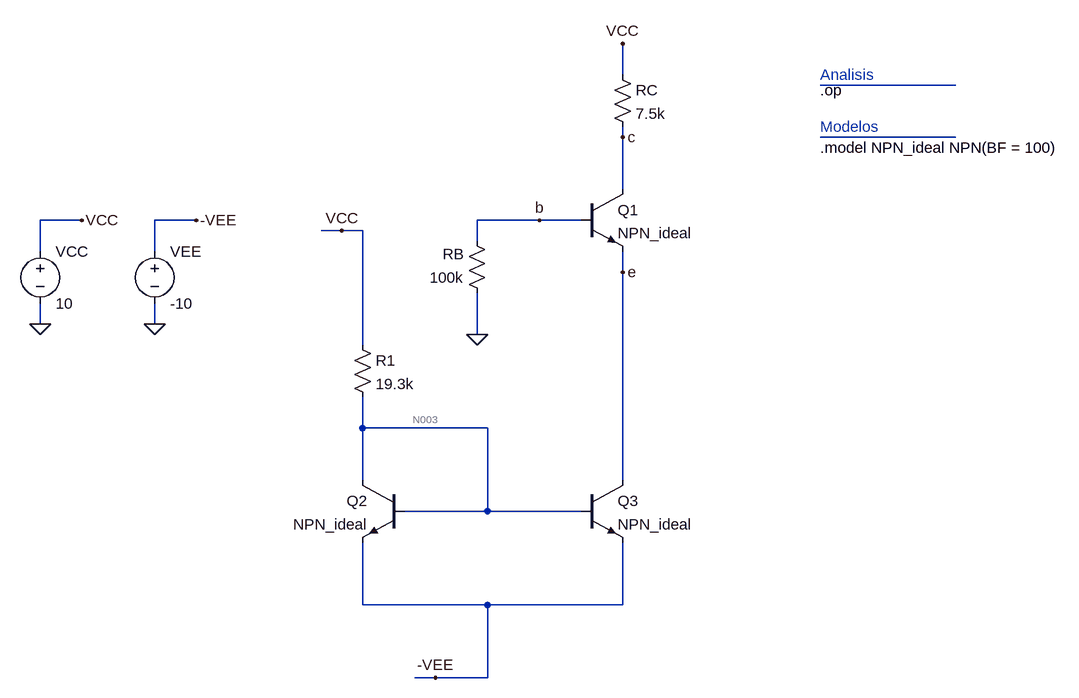
[diagram p0: schematic example4.asc]
example4.asc, the LTspice schematic file:
Version 4
SHEET 1 916 680
WIRE -368 -848 -368 -896
WIRE 144 -832 -64 -832
WIRE -368 -752 -368 -768
WIRE 144 -752 -64 -752
WIRE -368 -672 -368 -752
WIRE -1200 -624 -1264 -624
WIRE -1024 -624 -1088 -624
WIRE -496 -624 -592 -624
WIRE -432 -624 -496 -624
WIRE -800 -608 -832 -608
WIRE -768 -608 -800 -608
WIRE -592 -592 -592 -624
WIRE -1264 -576 -1264 -624
WIRE -1088 -576 -1088 -624
WIRE -368 -544 -368 -576
WIRE -1264 -464 -1264 -496
WIRE -1088 -464 -1088 -496
WIRE -592 -448 -592 -512
WIRE -768 -432 -768 -608
WIRE -768 -304 -768 -352
WIRE -576 -304 -768 -304
WIRE -768 -224 -768 -304
WIRE -368 -224 -368 -544
WIRE -576 -176 -576 -304
WIRE -576 -176 -704 -176
WIRE -432 -176 -576 -176
WIRE -768 -32 -768 -128
WIRE -576 -32 -768 -32
WIRE -368 -32 -368 -128
WIRE -368 -32 -576 -32
WIRE -656 80 -688 80
WIRE -576 80 -576 -32
WIRE -576 80 -656 80
FLAG -1264 -464 0
FLAG -496 -624 b
FLAG -368 -752 c
FLAG -368 -544 e
FLAG -1200 -624 VCC
FLAG -800 -608 VCC
FLAG -1088 -464 0
FLAG -1024 -624 -VEE
FLAG -656 80 -VEE
FLAG -368 -896 VCC
FLAG -592 -448 0
SYMBOL npn -432 -672 R0
SYMATTR InstName Q1
SYMATTR Value NPN_ideal
SYMBOL res -576 -496 R180
WINDOW 0 36 76 Left 2
WINDOW 3 36 40 Left 2
SYMATTR InstName RB
SYMATTR Value 100k
SYMBOL res -384 -864 R0
SYMATTR InstName RC
SYMATTR Value 7.5k
SYMBOL voltage -1264 -592 R0
WINDOW 123 0 0 Left 0
WINDOW 39 0 0 Left 0
SYMATTR InstName VCC
SYMATTR Value 10
SYMBOL npn -704 -224 M0
SYMATTR InstName Q2
SYMATTR Value NPN_ideal
SYMBOL npn -432 -224 R0
SYMATTR InstName Q3
SYMATTR Value NPN_ideal
SYMBOL res -784 -448 R0
SYMATTR InstName R1
SYMATTR Value 19.3k
SYMBOL voltage -1088 -592 R0
WINDOW 123 0 0 Left 0
WINDOW 39 0 0 Left 0
SYMATTR InstName VEE
SYMATTR Value -10
TEXT -64 -848 Left 2 ;Analisis
TEXT -64 -824 Left 2 !.op
TEXT -64 -736 Left 2 !.model NPN_ideal NPN(BF = 100)
TEXT -64 -768 Left 2 ;Modelos

The netlist it stands for:
* example4.asc
Q1 c b e 0 NPN_ideal
RB 0 b 100k
RC VCC c 7.5k
VCC VCC 0 10
Q2 N003 N003 -VEE 0 NPN_ideal
Q3 e N003 -VEE 0 NPN_ideal
R1 VCC N003 19.3k
VEE -VEE 0 -10
.model NPN NPN
.model PNP PNP
.lib standard.bjt
* Analisis
.op
.model NPN_ideal NPN(BF = 100)
* Modelos
.backanno
.end

* Results of the author's LTspice run, read from the files saved beside the schematic
* Operating Point:
*   V(c) = 2.748 V
*   V(b) = -967 mV
*   V(e) = -1.74 V
*   V(vcc) = 10 V
*   V(n003) = -9.226 V
*   V(-vee) = -10 V
*   Ic(Q3) = 976.7 µA
*   Ib(Q3) = 9.767 µA
*   Ie(Q3) = -986.4 µA
*   Ic(Q2) = 976.7 µA
*   Ib(Q2) = 9.767 µA
*   Ie(Q2) = -986.4 µA
*   Ic(Q1) = 967 µA
*   Ib(Q1) = 9.67 µA
*   Ie(Q1) = -976.7 µA
*   I(R1) = 996.2 µA
*   I(Rc) = 967 µA
*   I(Rb) = 9.67 µA
*   I(Vee) = 1.973 mA
*   I(Vcc) = -1.963 mA
* From the log:
*   Semiconductor Device Operating Points:
*                           --- Bipolar Transistors ---
*   Name:       q3          q2          q1
*   Model:   npn_ideal   npn_ideal   npn_ideal
*   Ib:       9.77e-06    9.77e-06    9.67e-06
*   Ic:       9.77e-04    9.77e-04    9.67e-04
*   Vbe:      7.74e-01    7.74e-01    7.73e-01
*   Vbc:     -7.49e+00    0.00e+00   -3.71e+00
*   Vce:      8.26e+00    7.74e-01    4.49e+00
*   BetaDC:   1.00e+02    1.00e+02    1.00e+02
*   Gm:       3.78e-02    3.78e-02    3.74e-02
*   Rpi:      2.65e+03    2.65e+03    2.67e+03
*   Rx:       0.00e+00    0.00e+00    0.00e+00
*   Ro:       0.00e+00    2.59e+14    6.08e+76
*   Cbe:      0.00e+00    0.00e+00    0.00e+00
*   Cbc:      0.00e+00    0.00e+00    0.00e+00
*   Cjs:      0.00e+00    0.00e+00    0.00e+00
*   BetaAC:   1.00e+02    1.00e+02    1.00e+02
*   Cbx:      0.00e+00    0.00e+00    0.00e+00
*   Ft:       0.00e+00    0.00e+00    0.00e+00